# EAGLE design B138X (EAGLE 6.6.0)
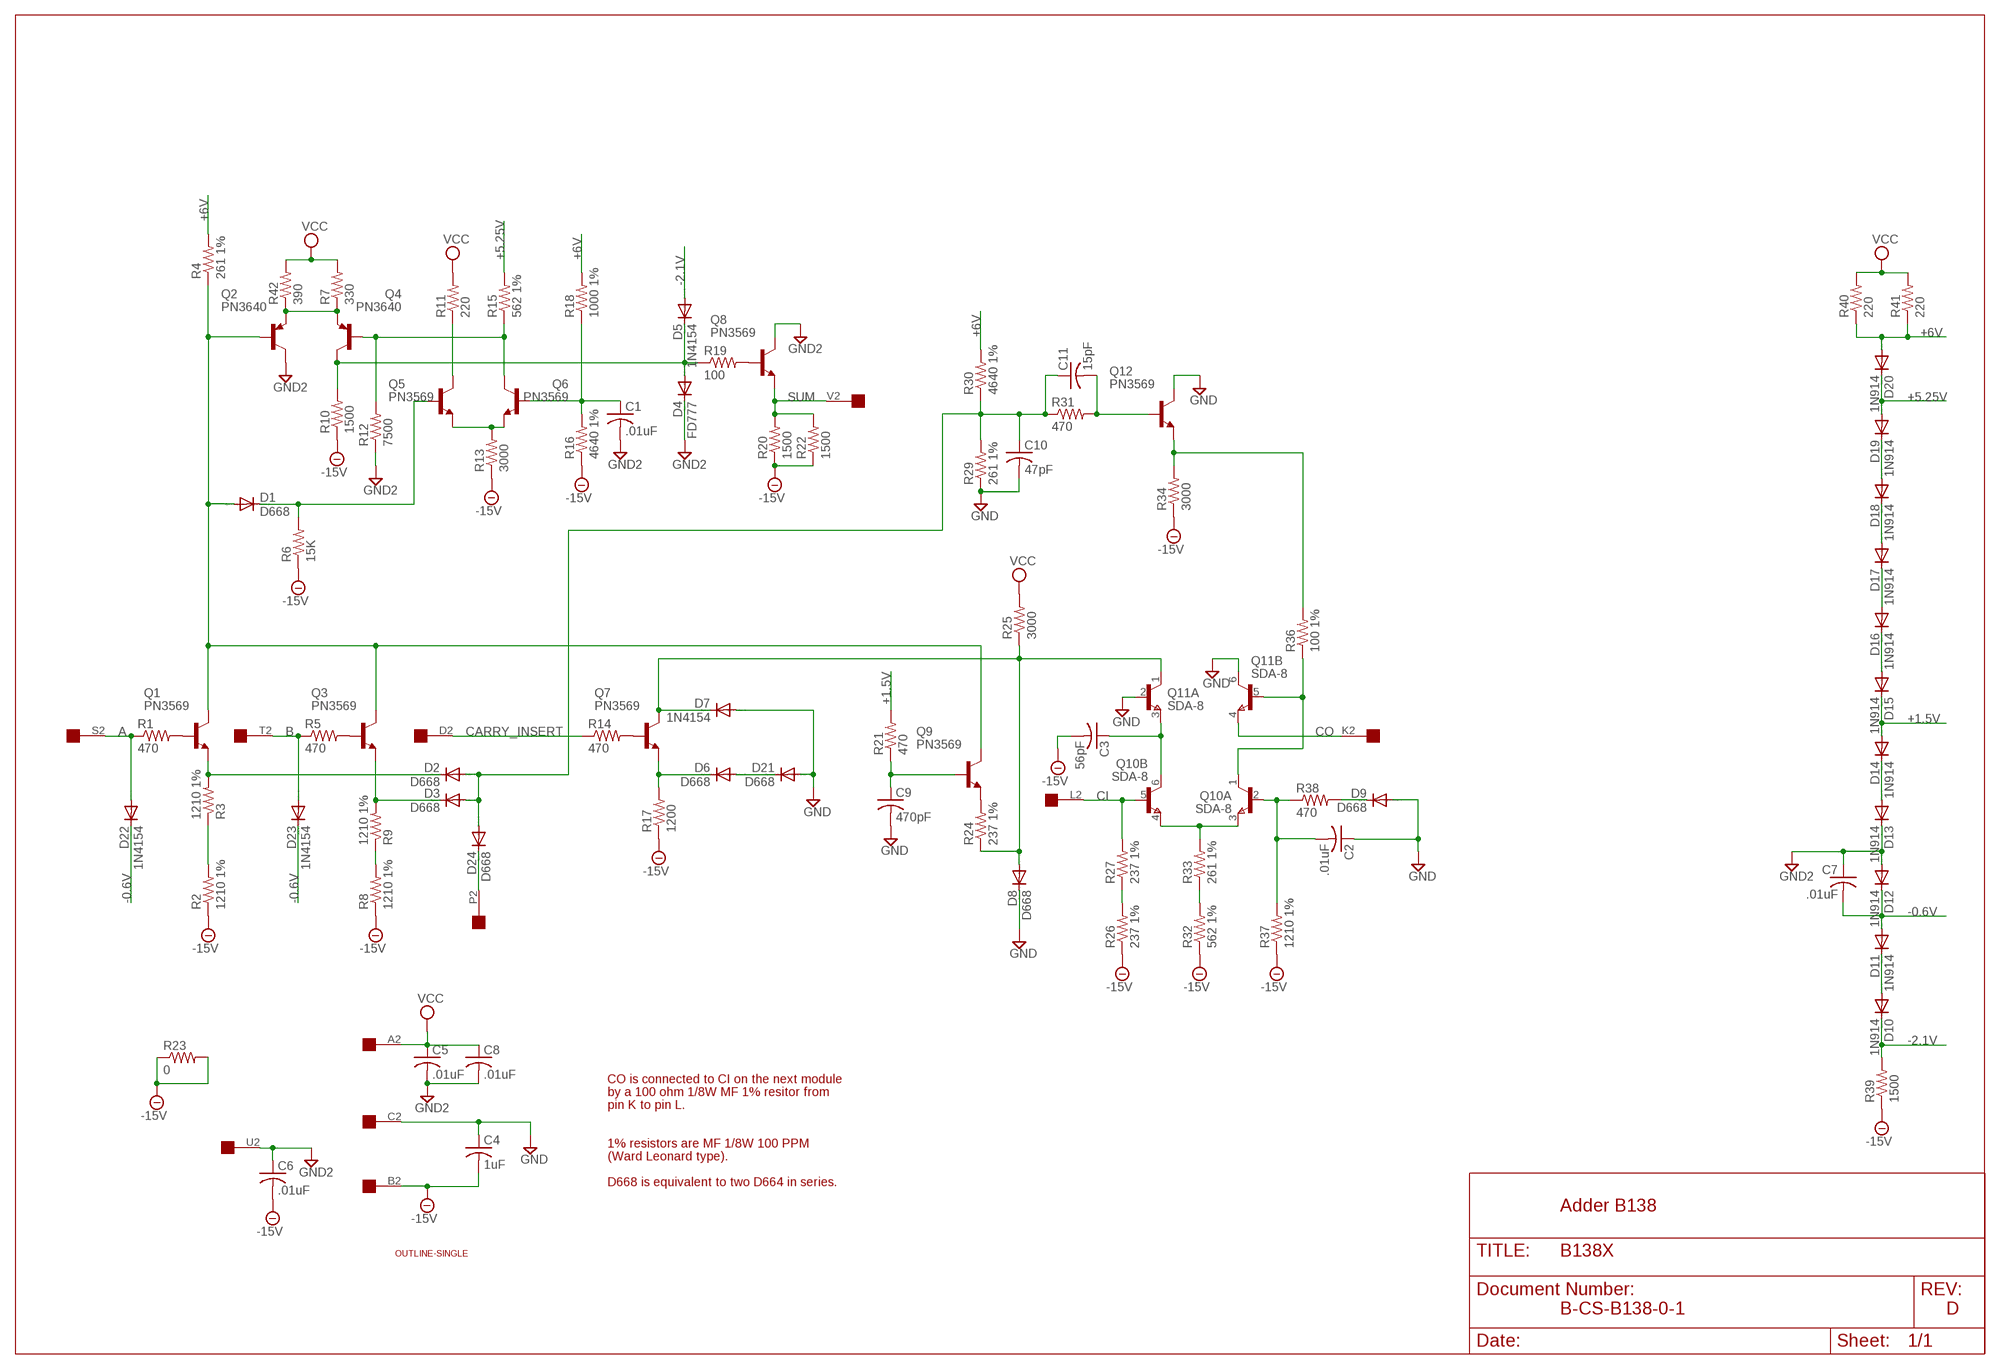
[diagram p0: schematic, sheet 1]

## Parts
C1  .01uF  C-US  [C063-025X075]
C2  .01uF  C-US  [C063-025X075]
C3  56pF  C-US  [C063-025X075]
C4  1uF  C-US102-043X133  [C102-043X133]
C5  .01uF  C-US  [C063-025X075]
C6  .01uF  C-US  [C063-025X075]
C7  .01uF  C-US  [C063-025X075]
C8  .01uF  C-US  [C063-025X075]
C9  470pF  C-US  [C063-025X075]
C10  47pF  C-US  [C063-025X075]
C11  15pF  C-US  [C063-025X075]
D1  D668  DIODE-DO35-10  [DO35-10]
D2  D668  DIODE-DO35-10  [DO35-10]
D3  D668  DIODE-DO35-10  [DO35-10]
D4  FD777  DIODE-DO35-10  [DO35-10]
D5  1N4154  DIODE-DO35-10  [DO35-10]
D6  D668  DIODE-DO35-10  [DO35-10]
D7  1N4154  DIODE-DO35-10  [DO35-10]
D8  D668  DIODE-DO35-10  [DO35-10]
D9  D668  DIODE-DO35-10  [DO35-10]
D10  1N914  DIODE-DO35-10  [DO35-10]
D11  1N914  DIODE-DO35-10  [DO35-10]
D12  1N914  DIODE-DO35-10  [DO35-10]
D13  1N914  DIODE-DO35-10  [DO35-10]
D14  1N914  DIODE-DO35-10  [DO35-10]
D15  1N914  DIODE-DO35-10  [DO35-10]
D16  1N914  DIODE-DO35-10  [DO35-10]
D17  1N914  DIODE-DO35-10  [DO35-10]
D18  1N914  DIODE-DO35-10  [DO35-10]
D19  1N914  DIODE-DO35-10  [DO35-10]
D20  1N914  DIODE-DO35-10  [DO35-10]
D21  D668  DIODE-DO35-10  [DO35-10]
D22  1N4154  DIODE-DO35-10  [DO35-10]
D23  1N4154  DIODE-DO35-10  [DO35-10]
D24  D668  DIODE-DO35-10  [DO35-10]
Q1  PN3569  -NPN-TO5  [TO5]
Q2  PN3640  -PNP-TO5  [TO5]
Q3  PN3569  -NPN-TO5  [TO5]
Q4  PN3640  -PNP-TO5  [TO5]
Q5  PN3569  -NPN-TO5  [TO5]
Q6  PN3569  -NPN-TO5  [TO5]
Q7  PN3569  -NPN-TO5  [TO5]
Q8  PN3569  -NPN-TO5  [TO5]
Q9  PN3569  -NPN-TO5  [TO5]
Q10  SDA-8  MAT-02H  [TO78]
Q11  SDA-8  MAT-02H  [TO78]
Q12  PN3569  -NPN-TO5  [TO5]
R1  470  R-US_0207/10  [0207/10]
R2  1210 1%  R-US_0207/15  [0207/15]
R3  1210 1%  R-US_0207/15  [0207/15]
R4  261 1%  R-US_0207/15  [0207/15]
R5  470  R-US_0207/10  [0207/10]
R6  15K  R-US_0207/10  [0207/10]
R7  330  R-US_0207/10  [0207/10]
R8  1210 1%  R-US_0207/15  [0207/15]
R9  1210 1%  R-US_0207/15  [0207/15]
R10  1500  R-US_0207/10  [0207/10]
R11  220  R-US_0207/10  [0207/10]
R12  7500  R-US_0207/10  [0207/10]
R13  3000  R-US_0207/10  [0207/10]
R14  470  R-US_0207/10  [0207/10]
R15  562 1%  R-US_0207/15  [0207/15]
R16  4640 1%  R-US_0207/15  [0207/15]
R17  1200  R-US_0207/10  [0207/10]
R18  1000 1%  R-US_0207/15  [0207/15]
R19  100  R-US_0207/10  [0207/10]
R20  1500  R-US_0207/10  [0207/10]
R21  470  R-US_0207/10  [0207/10]
R22  1500  R-US_0207/10  [0207/10]
R23  0  R-US_0207/10  [0207/10]
R24  237 1%  R-US_0207/15  [0207/15]
R25  3000  R-US_0207/10  [0207/10]
R26  237 1%  R-US_0207/15  [0207/15]
R27  237 1%  R-US_0207/15  [0207/15]
R29  261 1%  R-US_0207/15  [0207/15]
R30  4640 1%  R-US_0207/15  [0207/15]
R31  470  R-US_0207/10  [0207/10]
R32  562 1%  R-US_0207/15  [0207/15]
R33  261 1%  R-US_0207/15  [0207/15]
R34  3000  R-US_0207/10  [0207/10]
R36  100 1%  R-US_0207/15  [0207/15]
R37  1210 1%  R-US_0207/15  [0207/15]
R38  470  R-US_0207/10  [0207/10]
R39  1500  R-US_0207/10  [0207/10]
R40  220  R-US_0207/10  [0207/10]
R41  220  R-US_0207/10  [0207/10]
R42  390  R-US_0207/10  [0207/10]
U$1  OUTLINE-SINGLE  [SINGLE]
U$2  EDGE-1  [EDGE-CON1]

## Nets
+1.5V: D14.A D15.C R21.2
+5.25V: D19.A D20.C R15.2
+6V: D20.A R4.2 R18.2 R30.2 R40.1 R41.1
-0.6V: C7.2 D11.A D12.C D22.C D23.C
-2.1V: D5.A D10.C R39.2
-15V: C3.2 C4.2 C6.2 R2.1 R6.1 R8.1 R10.1 R13.1 R16.1 R17.1 R20.1 R22.1 R23.1 R23.2 R26.1 R32.1 R34.1 R37.1 R39.1 U$2.B2
A: D22.A R1.1 U$2.S2
B: D23.A R5.1 U$2.T2
CARRY_INSERT: R14.1 U$2.D2
CI: Q10.5(B:B) R27.2 U$2.L2
CO: Q11.4(B:E) U$2.K2
GND: C2.1 C4.1 C9.2 C10.2 D7.A D8.C D9.A D21.A Q11.2(A:B) Q11.6(B:C) Q12.3(C) R29.1 U$2.C2
GND2: C1.2 C5.2 C6.1 C7.1 C8.2 D4.C D12.A D13.C Q2.3(C) Q8.3(C) R12.1 U$2.U2
N$1: D1.A Q1.3(C) Q2.2(B) Q3.3(C) Q9.3(C) R4.1
N$2: D2.C Q1.1(E) R3.2
N$3: R2.2 R3.1
N$4: D3.C Q3.1(E) R9.2
N$5: R8.2 R9.1
N$6: Q1.2(B) R1.2
N$7: Q3.2(B) R5.2
N$8: D24.C U$2.P2
N$9: C10.1 C11.1 D2.A D3.A D24.A R29.2 R30.1 R31.1
N$10: D6.C Q7.1(E) R17.2
N$11: Q7.2(B) R14.2
N$12: D6.A D21.C
N$13: D7.C D8.A Q7.3(C) Q11.1(A:C) R24.1 R25.1
N$15: Q9.1(E) R24.2
N$16: C9.1 Q9.2(B) R21.1
N$17: Q10.3(A:E) Q10.4(B:E) R33.2
N$18: R32.2 R33.1
N$19: D17.A D18.C
N$20: D18.A D19.C
N$21: C3.1 Q10.6(B:C) Q11.3(A:E)
N$22: D15.A D16.C
N$23: D16.A D17.C
N$24: D13.A D14.C
N$25: Q10.1(A:C) Q11.5(B:B) R36.1
N$26: R26.2 R27.1
N$27: D10.A D11.C
N$28: C2.2 Q10.2(A:B) R37.2 R38.1
N$29: D9.C R38.2
N$30: Q2.1(E) Q4.1(E) R7.1 R42.1
N$31: C1.1 Q6.2(B) R16.2 R18.1
N$32: Q5.1(E) Q6.1(E) R13.2
N$33: Q5.3(C) R11.1
N$34: Q4.2(B) Q6.3(C) R12.2 R15.1
N$35: D4.A D5.C Q4.3(C) R10.2 R19.1
N$36: D1.C Q5.2(B) R6.2
N$37: Q8.2(B) R19.2
N$38: C11.2 Q12.2(B) R31.2
N$39: Q12.1(E) R34.2 R36.2
SUM: Q8.1(E) R20.2 R22.2 U$2.V2
VCC: C5.1 C8.1 R7.2 R11.2 R25.2 R40.2 R41.2 R42.2 U$2.A2
Unconnected: U$2.E2 U$2.F2 U$2.H2 U$2.J2 U$2.M2 U$2.N2 U$2.R2

## Notes on the sheet
- CO is connected to CI on the next module
- by a 100 ohm 1/8W MF 1% resitor from
- pin K to pin L.
- 1% resistors are MF 1/8W 100 PPM
- (Ward Leonard type).
- D668 is equivalent to two D664 in series.
- Adder B138
- B-CS-B138-0-1 | D

## Library data of the parts
C1-C3 C5-C11 = dec-con:C-US: Capacitors with funky DEC lead spacing.
C4 = rcl:C-US: CAPACITOR, American symbol
D1-D24 = diode:DIODE-: DIODE
Q1 Q3 Q5-Q9 Q12 = transistor:*-NPN-: NPN Transistror BF959 corrected 2008.03.06
Q2 Q4 = transistor:*-PNP-: PNP Transistror
Q10 Q11 = linear:MAT-02H: Dual TRANSISTOR
R1-R27 R29-R34 R36-R42 = rcl:R-US_: RESISTOR, American symbol
U$1 = dec-con:OUTLINE-*: Board outlines for DEC boards.
U$2 = dec-con:EDGE-1: Single-Sided DEC Edge Connector -- (side 2)

## Net classes
0 default: width 0.813 mm

## Board
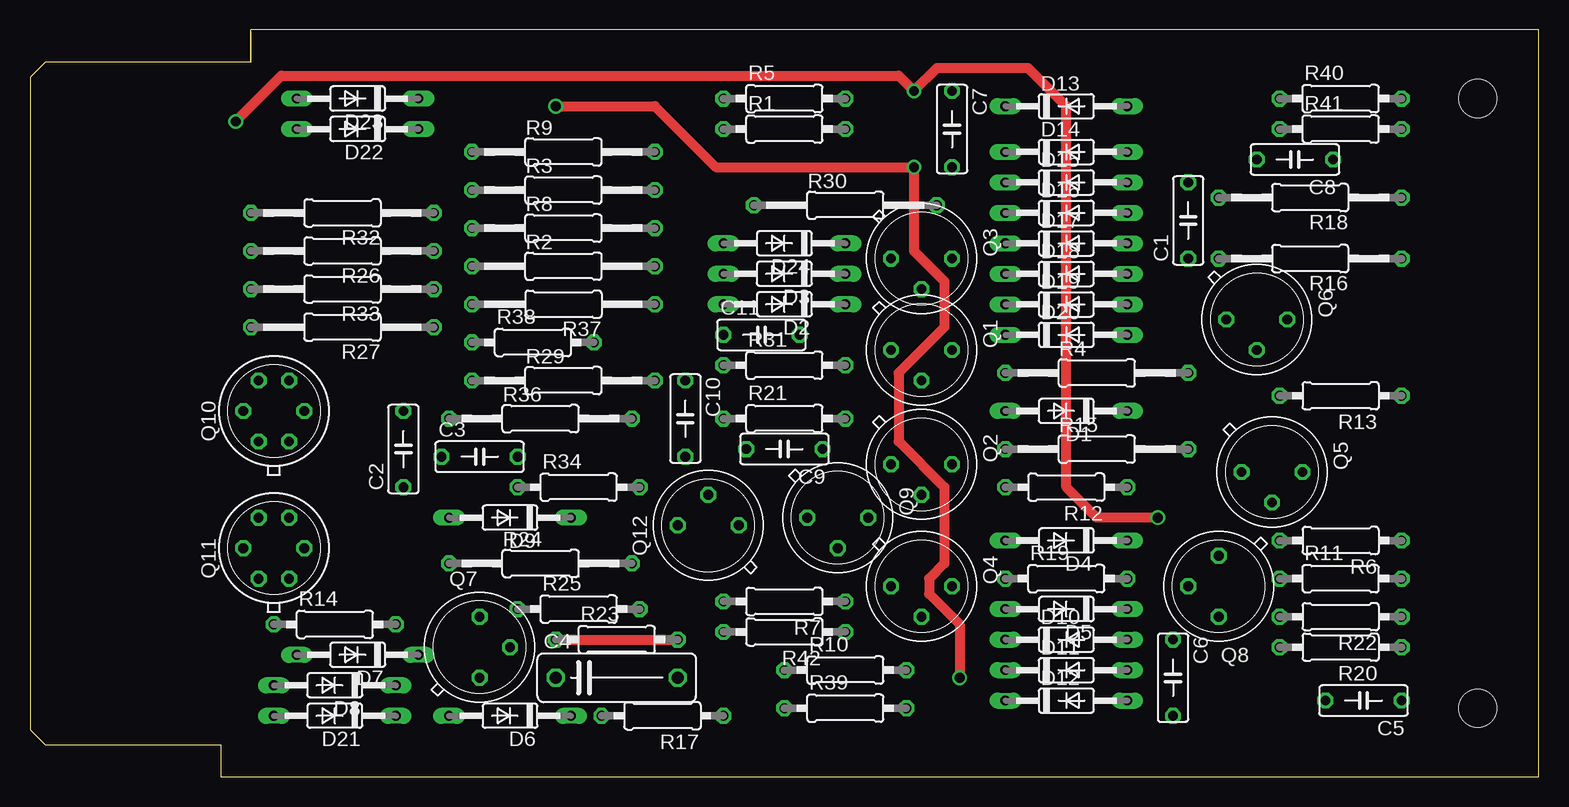
[diagram p1: board, top side]
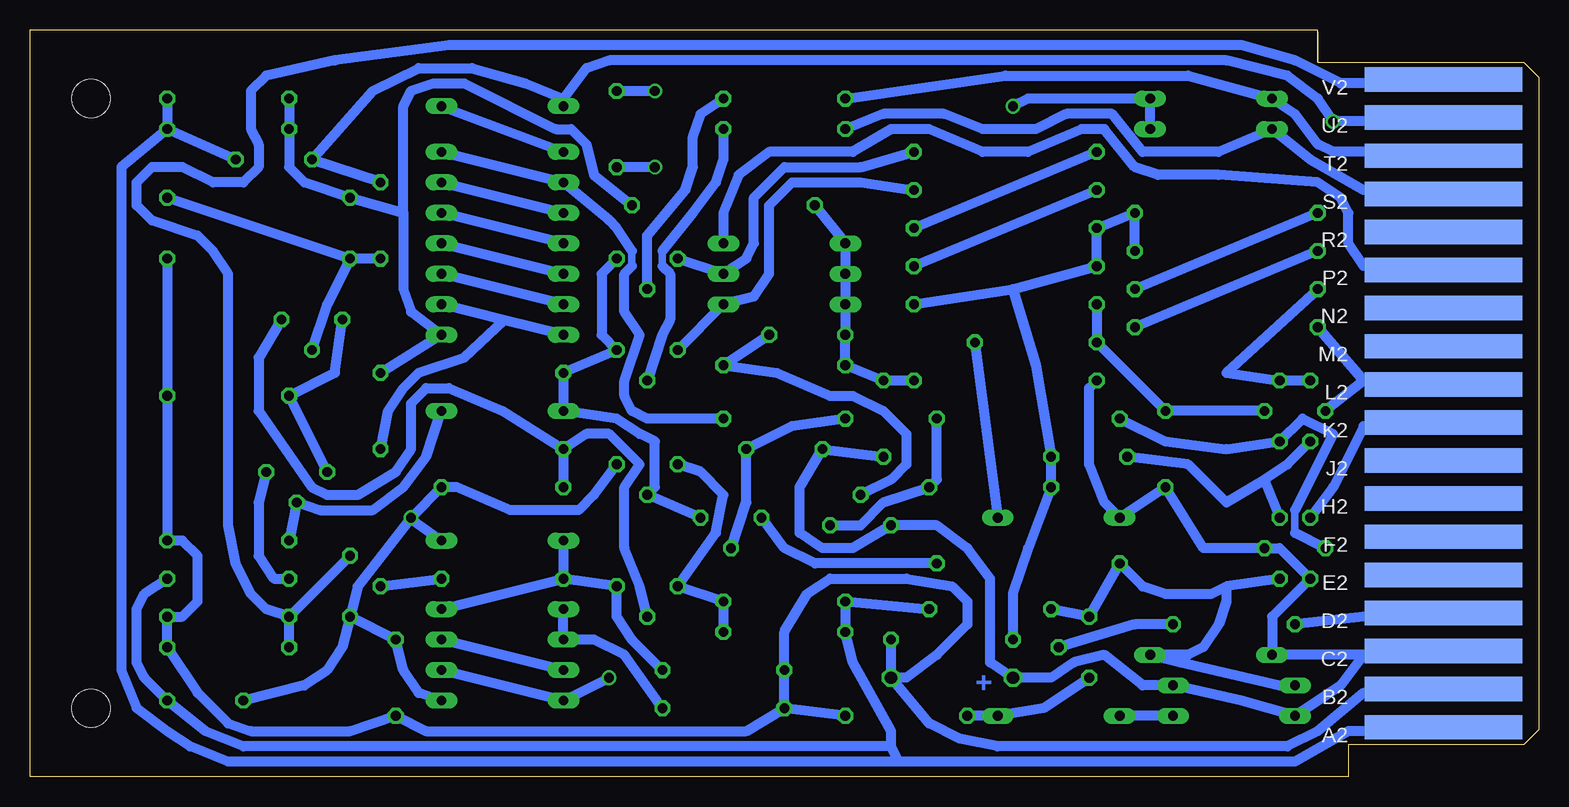
[diagram p2: board, bottom side, seen from below]

Size 125.73 x 62.23 mm. Coordinates in mm from the lower left corner, seen from the top.
Copper layers (1+16): Top 0.035mm / dielectric 1.5mm / Bottom 0.035mm
Design rules "16mils": minimum track width 16mil, minimum drill 32mil, track to track 15mil, track to pad 10mil, pad to pad 10mil, via to via 10mil, smd to smd 10mil, copper to edge 13mil, drill to drill 10mil, minimum pad ring 10mil, minimum via ring 8mil, stop-mask expansion 0mil, vias tented up to drill 0mil, thermal gap 10mil

### Footprints (pad centres in the part's own frame; a part is rotated, then mirrored left to right if it is on the bottom)
C063-025X075 = drill 0.813 octagon: 1 -2.54,0; 2 3.81,0
C102-043X133 = drill 1.016 octagon: 1 -5.08,0; 2 5.08,0
DO35-10 = drill 0.813 long: A 5.08,0; C -5.08,0
TO5 = drill 0.813 octagon: 1 0,-2.54; 2 2.54,0; 3 0,2.54
TO78 = drill 0.813 octagon: 1 -2.54,-1.27; 2 0,-2.54; 3 2.54,-1.27; 4 2.54,1.27; 5 0,2.54; 6 -2.54,1.27
0207/10 = drill 0.813 octagon: 1 -5.08,0; 2 5.08,0
0207/15 = drill 0.813 octagon: 1 -7.62,0; 2 7.62,0
SINGLE = hole 3.175: 120.65,56.515; 120.65,5.715
EDGE-CON1 = smd 13.106 x 2.032 bottom: A2 7.938,4.128; B2 7.938,7.303; C2 7.938,10.477; D2 7.938,13.652; E2 7.938,16.828; F2 7.938,20.003; H2 7.938,23.177; J2 7.938,26.352; K2 7.938,29.527; L2 7.938,32.703; M2 7.938,35.877; N2 7.938,39.053; P2 7.938,42.227; R2 7.938,45.403; S2 7.938,48.578; T2 7.938,51.752; U2 7.938,54.928; V2 7.938,58.102

### Placement (x,y rotation side)
C1  96.52,45.72 90 top
C2  31.12,26.67 90 top
C3  36.83,26.67 0 top
C4  48.9,8.26 0 top
C5  111.76,6.35 180 top
C6  95.25,8.89 270 top
C7  76.84,54.61 270 top
C8  106.05,51.44 180 top
C9  63.5,27.3 180 top
C10  54.61,30.48 270 top
C11  60.33,36.83 0 top
D1  86.36,30.48 180 top
D2  62.87,39.37 180 top
D3  62.87,41.91 180 top
D4  86.36,19.68 180 top
D5  86.36,13.97 180 top
D6  40.01,5.08 180 top
D7  27.31,10.16 180 top
D8  25.4,7.62 180 top
D9  40.01,21.59 180 top
D10  86.36,11.43 0 top
D11  86.36,8.89 0 top
D12  86.36,6.35 0 top
D13  86.36,55.88 0 top
D14  86.36,52.07 0 top
D15  86.36,49.53 0 top
D16  86.36,46.99 0 top
D17  86.36,44.45 0 top
D18  86.36,41.91 0 top
D19  86.36,39.37 0 top
D20  86.36,36.83 0 top
D21  25.4,5.08 180 top
D22  27.31,53.98 180 top
D23  27.31,56.52 180 top
D24  62.87,44.45 180 top
Q1  74.3,35.56 270 top
Q2  74.3,26.04 270 top
Q3  74.3,43.18 270 top
Q4  74.3,15.88 270 top
Q5  103.51,25.4 270 top
Q6  102.24,38.1 270 top
Q7  37.47,10.79 0 top
Q8  99.06,15.88 180 top
Q9  67.31,21.59 270 top
Q10  20.32,30.48 90 top
Q11  20.32,19.05 90 top
Q12  56.52,20.95 90 top
R1  62.87,53.98 0 top
R2  44.45,42.55 0 top
R3  44.45,48.9 0 top
R4  88.9,33.66 0 top
R5  62.87,56.52 0 top
R6  109.22,19.68 180 top
R7  62.87,14.61 180 top
R8  44.45,45.72 0 top
R9  44.45,52.07 0 top
R10  67.95,8.89 0 top
R11  109.22,16.51 0 top
R12  86.36,24.13 180 top
R13  109.22,31.75 180 top
R14  25.4,12.7 0 top
R15  88.9,27.3 0 top
R16  106.68,43.18 180 top
R17  52.71,5.08 180 top
R18  106.68,48.26 180 top
R19  86.36,16.51 0 top
R20  109.22,10.79 180 top
R21  62.87,29.84 0 top
R22  109.22,13.34 180 top
R23  48.9,11.43 0 top
R24  42.55,17.78 0 top
R25  45.72,13.97 0 top
R26  26.04,43.81 180 top
R27  26.04,37.47 180 top
R29  44.45,33.02 0 top
R30  67.95,47.62 0 top
R31  62.87,34.29 0 top
R32  26.04,46.99 180 top
R33  26.04,40.64 180 top
R34  45.72,24.13 0 top
R36  42.55,29.84 0 top
R37  44.45,39.37 180 top
R38  41.91,36.2 0 top
R39  67.95,5.71 0 top
R40  109.22,56.52 0 top
R41  109.22,53.98 0 top
R42  62.87,12.06 180 top
U$1  0,0 0 top
U$2  0,0 0 top

### Tracks (layer width: path | path; a pad name or v marks a point on that pad's centre or on a via)
+1.5V
  Bottom 0.61: 75.57,42.55 75.57,43.81
  Bottom 0.813: R21.2 74.3,29.84 75.57,30.48 76.2,31.75 76.2,33.02 74.93,36.83 76.2,38.73 76.2,41.91 75.57,42.55 | 75.57,43.81 76.84,45.72 77.47,46.35 D15.C D14.A
+5.25V
  Bottom 0.813: D20.C 86.21,38.06 | 86.21,38.06 D19.A | R15.2 95.89,30.48 94.62,32.38 93.35,33.66 89.54,34.92 86.21,38.06
+6V
  Bottom 0.813: R40.1 R41.1 104.14,50.8 102.87,49.53 R18.2 94.62,46.99 | 94.62,46.99 94.62,55.88 93.98,57.15 92.08,57.78 89.54,57.78 81.92,53.98 80.65,53.98 79.38,52.7 78.74,50.16 R30.2 | 94.62,46.99 94.62,40.64 93.98,38.73 D20.A R4.2
-0.6V  (via drill 0.81)
  Top 0.813: v43.82,55.88 52.07,55.88 57.15,50.8 v73.66,50.8 73.66,43.81 76.2,41.27 76.2,37.47 72.39,33.66 72.39,27.94 76.2,24.13 76.2,17.78 74.93,16.51 74.93,15.24 77.47,12.7 v77.47,8.26
  Bottom 0.813: D11.A D12.C v77.47,8.26 | D22.C D23.C 42.55,56.52 v43.82,55.88 | v73.66,50.8 C7.2
-2.1V
  Bottom 0.813: R39.2 76.2,10.16 78.74,11.43 D10.C D5.A
-15V
  Top 0.813: R23.1 R23.2
  Bottom 0.813: U$2.B2 8.26,6.99 14.61,6.99 18.42,3.81 20.96,2.54 45.09,2.54 48.26,3.17 50.8,4.45 C4.2 | C4.2 R23.2 | R17.1 R39.1 | R39.1 R10.1 62.87,12.06 60.96,15.24 59.06,16.51 52.71,16.51 48.9,15.88 47.63,14.61 47.63,12.7 50.17,10.16 52.71,8.26 C4.2 | R26.1 R32.1 R8.1 R2.1 43.82,40.64 | R39.1 66.04,3.81 92.71,3.81 C6.2 99.06,3.81 107.32,3.81 109.22,4.45 111.76,6.99 R20.1 R22.1 113.03,13.34 111.76,14.61 111.76,18.41 113.03,19.68 R6.1 R13.1 R16.1 | R37.1 43.82,40.64 | 43.82,40.64 41.91,34.29 C3.2 R34.1 42.55,19.05 43.82,15.24 R23.1
A
  Bottom 0.813: U$2.S2 8.89,48.9 14.61,48.9 19.05,51.44 D22.A 26.67,52.07 33.02,52.07 35.56,55.24 39.37,55.24 41.91,53.98 46.36,53.98 49.53,55.24 54.61,55.24 R1.1
B
  Bottom 0.813: U$2.T2 9.53,52.07 17.15,52.07 18.42,52.7 20.32,55.24 D23.A 29.21,58.42 44.45,58.42 R5.1
CARRY_INSERT
  Bottom 0.813: U$2.D2 8.89,13.34 14.61,13.34 R14.1
CI
  Bottom 0.813: R27.2 14.61,33.02 | 14.61,33.02 8.89,33.02 U$2.L2 | 14.61,33.02 Q10.5
CO
  Bottom 0.813: U$2.K2 8.26,29.21 14.61,29.21 17.15,24.13 Q11.4
GND
  Bottom 0.813: C10.2 C9.2 61.6,24.13 61.6,20.32 59.69,19.05 57.15,19.05 Q12.3 50.17,20.95 47.63,19.05 45.72,16.51 45.72,9.53 C4.1 40.64,8.26 38.74,9.53 36.2,10.16 33.02,7.62 D8.C 24.77,6.35 D21.A 16.51,7.62 14.61,10.16 | R29.1 37.47,32.38 37.47,26.04 36.2,22.86 D9.A C2.1 27.94,19.05 Q11.2 21.59,19.05 Q11.6 22.23,13.34 D7.A 14.61,10.16 | U$2.C2 8.89,10.16 14.61,10.16
GND2  (via drill 0.81)
  Top 0.813: v93.98,21.59 88.9,21.59 86.36,24.13 86.36,55.88 83.19,59.05 75.57,59.05 v73.66,57.15 72.39,58.42 20.96,58.42 v17.15,54.61
  Bottom 0.813: Q8.3 99.7,10.79 100.97,8.89 102.87,7.62 C5.2 | Q2.3 78.74,23.5 80.01,22.23 85.73,22.23 90.17,24.13 R12.1 v93.98,21.59 94.05,21.5 | 94.05,21.5 98.43,15.88 Q8.3 | D4.C 94.05,21.5 | D12.A 93.35,6.99 94.62,8.89 C6.1 Q8.3 | U$2.U2 8.26,54.61 v17.15,54.61 18.42,56.52 20.96,58.42 26.04,59.69 77.47,59.69 79.38,59.05 81.28,56.52 | C1.2 C8.2 97.16,57.15 93.35,59.05 88.9,59.05 84.46,57.78 81.28,56.52 | 81.28,56.52 D13.C | C7.1 v73.66,57.15
N$1
  Bottom 0.813: Q9.3 Q2.2 73.66,24.13 73.66,27.94 74.93,28.57 76.84,29.84 D1.A R4.1 Q1.3 78.11,36.83 78.11,41.91 Q3.3
N$2
  Bottom 0.813: Q1.1 D2.C 65.41,40.01 64.14,41.91 64.14,47.62 62.23,49.53 56.52,49.53 R3.2
N$3
  Bottom 0.813: R3.1 R2.2
N$4
  Bottom 0.813: Q3.1 D3.C 66.04,43.18 65.41,44.45 65.41,48.26 62.87,50.8 56.52,50.8 R9.2
N$5
  Bottom 0.813: R9.1 R8.2
N$6
  Bottom 0.61: 73.03,43.81 73.03,42.55
  Bottom 0.813: R1.2 67.95,51.44 68.58,49.53 70.49,46.99 73.03,43.81 | 73.03,42.55 72.39,41.91 72.39,38.1 73.03,36.83 Q1.2
N$7
  Bottom 0.813: Q3.2 74.3,45.09 71.12,48.9 70.49,50.8 70.49,53.34 69.85,55.24 R5.2
N$8
  Bottom 0.813: U$2.P2 8.89,42.55 14.61,42.55 15.88,44.45 15.88,46.99 16.51,48.26 18.42,49.53 26.67,50.16 31.75,50.16 33.66,50.8 36.2,53.98 38.1,53.98 42.55,52.07 46.36,52.07 50.8,53.98 53.98,53.98 57.15,52.07 64.14,52.07 66.68,50.16 67.95,46.99 D24.C
N$9
  Bottom 0.813: R29.2 C10.1 R31.1 C11.1 D2.A D3.A D24.A R30.1
N$10
  Bottom 0.813: Q7.1 41.28,5.71 D6.C R17.2
N$11
  Bottom 0.813: R14.2 33.66,12.7 Q7.2
N$12
  Bottom 0.813: D21.C D6.A
N$13
  Bottom 0.813: 26.04,15.88 27.31,15.24 31.12,15.24 33.02,15.88 R24.1 Q7.3 R25.1 | 26.04,15.88 26.04,14.61 26.67,12.7 27.94,10.79 29.21,10.16 D7.C 29.85,9.53 21.59,7.62 D8.A | Q11.1 26.04,15.88
N$15
  Bottom 0.813: R24.2 60.33,17.78 62.87,19.05 Q9.1
N$16
  Bottom 0.813: Q9.2 66.04,22.86 C9.1 62.23,29.21 R21.1
N$17
  Bottom 0.813: Q10.4 Q10.3 26.04,33.66 R33.2
N$18
  Bottom 0.813: R32.2 R33.1
N$19
  Bottom 0.813: D17.A D18.C
N$20
  Bottom 0.813: D19.C D18.A
N$21
  Bottom 0.813: Q10.6 20.96,26.04 22.86,24.77 | 22.86,24.77 26.04,22.86 29.21,26.04 C3.1 | 22.86,24.77 Q11.3
N$22
  Bottom 0.813: D15.A D16.C
N$23
  Bottom 0.813: D17.C D16.A
N$24
  Bottom 0.813: D13.A D14.C
N$25
  Bottom 0.61: 20.32,22.23 20.32,20.32
  Bottom 0.813: Q11.5 20.32,20.32 | R36.1 31.12,27.94 26.04,27.3 Q10.1 19.69,29.84 17.15,28.57 20.32,22.23
N$26
  Bottom 0.813: R26.2 R27.1
N$27
  Bottom 0.813: D11.C D10.A
N$28
  Bottom 0.813: Q10.2 C2.2 R38.1 R37.2
N$29
  Bottom 0.813: R38.2 D9.C
N$30
  Bottom 0.813: R42.1 R7.1 Q4.1 68.58,20.32 67.95,23.5 69.85,25.4 Q2.1
N$31
  Bottom 0.813: R16.2 R18.1 | R16.2 100.97,39.37 Q6.2 | C1.1 R16.2
N$32
  Bottom 0.813: Q5.1 R13.2 100.33,33.66 Q6.1
N$33
  Bottom 0.813: Q5.3 106.68,22.86 106.68,18.41 105.41,16.51 R11.1
N$34
  Bottom 0.813: Q4.2 74.93,15.88 76.2,19.05 76.2,24.13 74.93,26.04 77.47,28.57 79.38,28.57 R15.1 | R15.1 R12.2 | Q6.3 106.68,34.92 106.68,30.48 102.24,24.13 100.97,23.5 98.43,23.5 95.25,25.4 93.98,27.3 93.98,31.11 92.71,32.38 90.81,32.38 86.36,30.48 R15.1
N$35
  Bottom 0.813: R19.1 Q4.3 76.84,13.34 75.57,11.43 R10.2 | D4.A R19.1 | D5.C R19.1
N$36
  Bottom 0.813: R6.2 Q5.2 101.6,22.23 97.16,22.23 94.62,24.13 92.71,26.67 D1.C
N$37
  Bottom 0.813: Q8.2 R19.2
N$38
  Bottom 0.813: C11.2 R31.2 63.5,33.66 59.06,31.75 57.15,31.75 54.61,30.48 52.71,28.57 52.71,26.04 53.98,24.77 Q12.2
N$39
  Bottom 0.813: Q12.1 56.52,20.95 54.61,22.86 R34.2 50.17,24.77 R36.2
SUM
  Bottom 0.813: U$2.V2 8.26,57.78 16.51,57.78 20.32,59.69 24.77,60.96 90.81,60.96 100.33,59.69 106.05,58.42 107.32,57.15 107.32,53.98 106.68,52.7 106.68,50.8 107.95,49.53 110.49,49.53 113.03,50.8 115.57,50.8 116.84,49.53 116.84,47.62 115.57,46.35 111.76,45.09 110.49,43.81 109.22,41.91 109.22,20.95 108.59,17.78 107.32,15.24 106.05,13.97 R22.2 | R20.2 R22.2 | Q8.1 R22.2
VCC
  Bottom 0.813: U$2.A2 8.26,3.81 15.88,3.81 20.32,1.27 53.34,1.27 | 53.34,1.27 109.22,1.27 112.4,2.54 114.3,3.81 116.84,5.71 118.11,8.89 118.11,50.8 R41.2 | 53.34,1.27 53.98,2.54 | 53.98,2.54 107.95,2.54 111.13,3.81 C5.1 116.21,8.26 116.84,9.53 116.84,13.97 116.21,15.24 R11.2 | 53.98,2.54 53.98,3.81 57.15,9.53 R42.2 R7.2 R25.2 | R40.2 R41.2 | C8.1 R41.2

### Text on the board
Bottom: +